# Altium schematic sheet ESP32-S2-Ink.SchDoc
size Tabloid; SheetNumber: 1; SheetTotal: 1
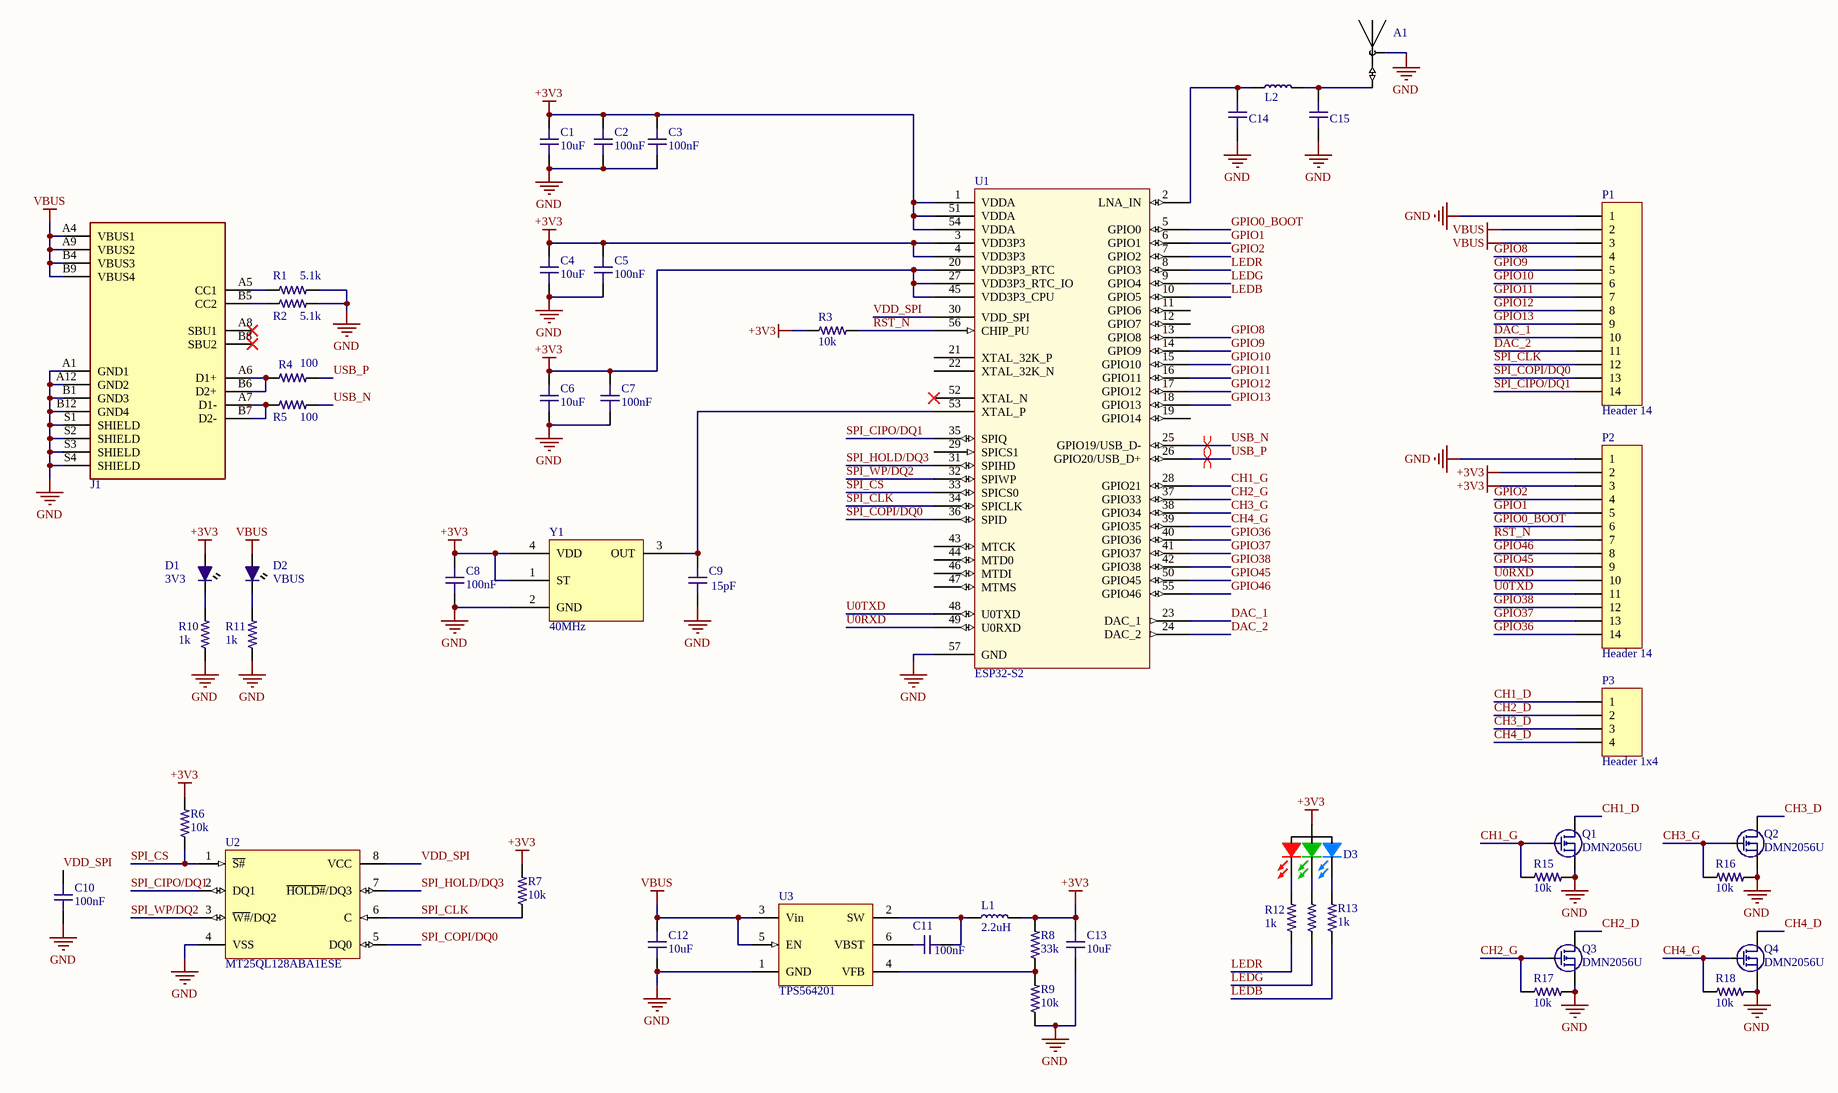
[diagram p0: ESP32-S2-Ink.SchDoc]

## Parts
A1  0479480001  [0479480001]  (value not drawn)
C1  value 10uF  [C0402-HIGH-DENSITY]  (hidden comment: C0402 10uF 10V)
C2  value 100nF  [C0402-HIGH-DENSITY]  (hidden comment: C0402 100nF 10V X5R)
C3  value 100nF  [C0402-HIGH-DENSITY]  (hidden comment: C0402 100nF 10V X5R)
C4  value 10uF  [C0402-HIGH-DENSITY]  (hidden comment: C0402 10uF 10V)
C5  value 100nF  [C0402-HIGH-DENSITY]  (hidden comment: C0402 100nF 10V X5R)
C6  value 10uF  [C0402-HIGH-DENSITY]  (hidden comment: C0402 10uF 10V)
C7  value 100nF  [C0402-HIGH-DENSITY]  (hidden comment: C0402 100nF 10V X5R)
C8  value 100nF  [C0402-HIGH-DENSITY]  (hidden comment: C0402 100nF 10V X5R)
C9  value 15pF  [C0402-HIGH-DENSITY]  (hidden comment: C0402 15pF 50V C0G)
C10  value 100nF  [C0402-HIGH-DENSITY]  (hidden comment: C0402 100nF 10V X5R)
C11  value 100nF  [C0402-HIGH-DENSITY]  (hidden comment: C0402 100nF 10V X5R)
C12  value 10uF  [C0402-HIGH-DENSITY]  (hidden comment: C0402 10uF 10V)
C13  value 10uF  [C0402-HIGH-DENSITY]  (hidden comment: C0402 10uF 10V)
C14  0402 Capacitor Template  [C0402-HIGH-DENSITY]  (value not drawn)
C15  0402 Capacitor Template  [C0402-HIGH-DENSITY]  (value not drawn)
D1  3V3  [LED0603-IPC]
D2  VBUS  [LED0603-IPC]
D3  RGB  [LED_0606_RGB_WURTH]  (value not drawn)
J1  16 Pin Mid Mount USB C  [USB-C - 16 Pin Mid Mount]  (value not drawn)
L1  value 2.2uH  [L1008]  (hidden comment: SDEM25201B-2R2MS)
L2  ! Inductor Template  [L0402-Murata-WW-High-Density]  (value not drawn)
P1  Header 14  [HDR1X14]
P2  Header 14  [HDR1X14]
P3  Header 1x4  [HEADER 1X4 SMD 2.54mm]
Q1  DMN2056U  [SOT23-DMN2056]
Q2  DMN2056U  [SOT23-DMN2056]
Q3  DMN2056U  [SOT23-DMN2056]
Q4  DMN2056U  [SOT23-DMN2056]
R1  value 5.1k  [R0402-HIGH-DENSITY]  (hidden comment: R0402 5.1K 1%)
R2  value 5.1k  [R0402-HIGH-DENSITY]  (hidden comment: R0402 5.1K 1%)
R3  value 10k  [R0402-HIGH-DENSITY]  (hidden comment: R0402 10k 1%)
R4  value 100  [R0402-HIGH-DENSITY]  (hidden comment: R0402 100R 1%)
R5  value 100  [R0402-HIGH-DENSITY]  (hidden comment: R0402 100R 1%)
R6  value 10k  [R0402-HIGH-DENSITY]  (hidden comment: R0402 10k 1%)
R7  value 10k  [R0402-HIGH-DENSITY]  (hidden comment: R0402 10k 1%)
R8  value 33k  [R0402-HIGH-DENSITY]  (hidden comment: R0402 33k 1%)
R9  value 10k  [R0402-HIGH-DENSITY]  (hidden comment: R0402 10k 1%)
R10  value 1k  [R0402-HIGH-DENSITY]  (hidden comment: R0402 1k 1%)
R11  value 1k  [R0402-HIGH-DENSITY]  (hidden comment: R0402 1k 1%)
R12  value 1k  [R0402-HIGH-DENSITY]  (hidden comment: R0402 1k 1%)
R13  value 1k  [R0402-HIGH-DENSITY]  (hidden comment: R0402 1k 1%)
R14  R0402 1k 1%  [R0402-HIGH-DENSITY]  (value not drawn)
R15  value 10k  [R0402-HIGH-DENSITY]  (hidden comment: R0402 10k 1%)
R16  value 10k  [R0402-HIGH-DENSITY]  (hidden comment: R0402 10k 1%)
R17  value 10k  [R0402-HIGH-DENSITY]  (hidden comment: R0402 10k 1%)
R18  value 10k  [R0402-HIGH-DENSITY]  (hidden comment: R0402 10k 1%)
U1  ESP32-S2  [QFN56]
U2  MT25QL128ABA1ESE  [SOIC127P800X216-8N]
U3  TPS564201  [SOT95P280X90-6N]
Y1  40MHz  [SiT8008B]

## Nets
+3V3: C1.2 C2.2 C3.2 C4.2 C5.2 C6.2 C7.2 C8.2 C13.2 D1.A D3.A L1.2 P2.2 P2.3 R3.1 R6.1 R7.1 R8.2 U1.1(VDDA) U1.3(VDD3P3) U1.4(VDD3P3) U1.20(VDD3P3_RTC) U1.27(VDD3P3_RTC_IO) U1.45(VDD3P3_CPU) U1.51(VDDA) U1.54(VDDA) Y1.1(ST) Y1.4(VDD)
GND: A1.2 C1.1 C2.1 C3.1 C4.1 C5.1 C6.1 C7.1 C8.1 C9.1 C10.1 C12.1 C13.1 C14.1 C15.1 J1.A1(GND1) J1.A12(GND2) J1.B1(GND3) J1.B12(GND4) J1.S1(SHIELD) J1.S2(SHIELD) J1.S3(SHIELD) J1.S4(SHIELD) P1.1 P2.1 Q1.2(S) Q2.2(S) Q3.2(S) Q4.2(S) R1.2 R2.2 R9.1 R10.1 R11.1 R15.1 R16.1 R17.1 R18.1 U1.57(GND) U2.4(VSS) U3.1(GND) Y1.2(GND)
VBUS: C12.2 D2.A J1.A4(VBUS1) J1.A9(VBUS2) J1.B4(VBUS3) J1.B9(VBUS4) P1.2 P1.3 U3.3(Vin) U3.5(EN)
CH1_D: P3.1 Q1.3(D)
CH1_G: Q1.1(G) R15.2 U1.28(GPIO21)
CH2_D: P3.2 Q3.3(D)
CH2_G: Q3.1(G) R17.2 U1.37(GPIO33)
CH3_D: P3.3 Q2.3(D)
CH3_G: Q2.1(G) R16.2 U1.38(GPIO34)
CH4_D: P3.4 Q4.3(D)
CH4_G: Q4.1(G) R18.2 U1.39(GPIO35)
DAC_1: P1.10 U1.23(DAC_1)
DAC_2: P1.11 U1.24(DAC_2)
GPIO0_BOOT: P2.6 U1.5(GPIO0)
GPIO1: P2.5 U1.6(GPIO1)
GPIO2: P2.4 U1.7(GPIO2)
GPIO8: P1.4 U1.13(GPIO8)
GPIO9: P1.5 U1.14(GPIO9)
GPIO10: P1.6 U1.15(GPIO10)
GPIO11: P1.7 U1.16(GPIO11)
GPIO12: P1.8 U1.17(GPIO12)
GPIO13: P1.9 U1.18(GPIO13)
GPIO36: P2.14 U1.40(GPIO36)
GPIO37: P2.13 U1.41(GPIO37)
GPIO38: P2.12 U1.42(GPIO38)
GPIO45: P2.9 U1.50(GPIO45)
GPIO46: P2.8 U1.55(GPIO46)
LEDB: R13.1 U1.10(GPIO5)
LEDG: R14.1 U1.9(GPIO4)
LEDR: R12.1 U1.8(GPIO3)
RST_N: P2.7 R3.2 U1.56(CHIP_PU)
SPI_CIPO/DQ1: P1.14 U1.35(SPIQ) U2.2(DQ1)
SPI_CLK: P1.12 R7.2 U1.34(SPICLK) U2.6(C)
SPI_COPI/DQ0: P1.13 U1.36(SPID) U2.5(DQ0)
SPI_CS: R6.2 U1.33(SPICS0) U2.1(~{S#})
SPI_HOLD/DQ3: U1.31(SPIHD) U2.7(~{HOLD#}/DQ3)
SPI_WP/DQ2: U1.32(SPIWP) U2.3(~{W#}/DQ2)
U0RXD: P2.10 U1.49(U0RXD)
U0TXD: P2.11 U1.48(U0TXD)
USB_N: R5.2 U1.25(GPIO19/USB_D-)
USB_P: R4.2 U1.26(GPIO20/USB_D+)
VDD_SPI: C10.2 U1.30(VDD_SPI) U2.8(VCC)
NetA1_1: A1.1(FEED) C15.2 L2.2
NetC9_2: C9.2 U1.53(XTAL_P) Y1.3(OUT)
NetC11_1: C11.1 L1.1 U3.2(SW)
NetC11_2: C11.2 U3.6(VBST)
NetC14_2: C14.2 L2.1 U1.2(LNA_IN)
NetD1_K: D1.K R10.2
NetD2_K: D2.K R11.2
NetD3_BK: D3.BK R13.2
NetD3_GK: D3.GK R14.2
NetD3_RK: D3.RK R12.2
NetJ1_A5: J1.A5(CC1) R1.1
NetJ1_A6: J1.A6(D1+) J1.B6(D2+) R4.1
NetJ1_A7: J1.A7(D1-) J1.B7(D2-) R5.1
NetJ1_B5: J1.B5(CC2) R2.1
NetR8_1: R8.1 R9.2 U3.4(VFB)

Not connected (* = marked no-connect by the designer): J1 A8(SBU1)* B8(SBU2)*; U1 11(GPIO6) 12(GPIO7) 19(GPIO14) 21(XTAL_32K_P) 22(XTAL_32K_N) 29(SPICS1) 43(MTCK) 44(MTD0) 46(MTDI) 47(MTMS) 52(XTAL_N)*

## Layout directives
differential pair: USB_N, USB_P

## Library data of the parts
A1 = Molex 0479480001: 2.4GHz Bluetooth, WLAN, Zigbee™ Chip RF Antenna 2.4GHz ~ 2.483.5GHz 3dBi Solder Surface Mount; Supplier 1: Digi-Key; Supplier 2: Mouser; Supplier Part Number 2: 538-47948-0001; Supplier Part Number 1: WM4893CT-ND
C1 C4 C6 C12 C13 = C0402 10uF 10V: Chip Capacitor, 0402, 10uF, 10V, X5R; EIA Code: X5R; Max. Voltage: 10V; Supplier 1: Digi-Key; Supplier Part Number 1: 1276-1450-2-ND
C2 C3 C5 C7 C8 C10 C11 = C0402 100nF 10V X5R: Chip Capacitor, 0402, 100nF, 10V, X5R; EIA Code: X5R; Max. Voltage: 10V; Supplier 1: Digi-Key; Supplier Part Number 1: 311-1336-1-ND
C9 = C0402 16pF 50V C0G: Chip Capacitor, 0402, 15pF, 50V, C0G; Max. Voltage: 50V; Supplier 1: Digi-Key; Supplier Part Number 1: 490-5926-1-ND; EIA Code: C0G
C14 C15 = 0402 Capacitor Template: Chip Capacitor, 0402, ??nF, 10V, X7R; EIA Code: X7R; Max. Voltage: 10V; Value: ??nF
D1 D2 = LED 0603 Yellow: LED YELLOW CLEAR 0603 SMD; Supplier 1: Digi-Key; Supplier Part Number 1: 732-4981-1-ND
D3 = Led_RGB_0606: RGB Led 1.6 x 1.6 mm Diffused; Manufacturer: Everlight; Manufacturer Part Number: 19-237/R6GHBHW-C01/2T; Supplier 1: Digi-Key; Supplier Part Number 1: 1080-1590-1-ND
J1 = USB C USB 2.0 and PD: USB-C USB 2.0 5A PD 16 Position Mid Mount; Manufacturer: Jing Extension of the Electronic Co; Supplier 1: LCSC; Supplier Part Number 1: C168688
L1 = SDEM25201B-2R2MS: 2.2µH Shielded Inductor 2.05A 117mOhm Max 1008 (2520 Metric); Supplier 1: Digi-Key; Supplier Part Number 1: 2037-SDEM25201B-2R2MSCT-ND
L2 = ! Inductor Template: Inductor, ??uH; Value: ??H
P1 P2 = Header 14: Header, 14-Pin; LatestRevisionDate: 17-Jul-2002; LatestRevisionNote: Re-released for DXP Platform.; Publisher: Altium Limited
P3 = Header 1x4: Header, 4-Pin; LatestRevisionDate: 17-Jul-2002; LatestRevisionNote: Re-released for DXP Platform.; Publisher: Altium Limited
Q1-Q4 = DMN2056U: MOSFET N-Ch -20V VDSS Enchanced Mosfet 4.2A; Supplier 1: Digi-Key; Supplier Part Number 1: DMN2056U-7DICT-ND
R1 R2 = R0402 5.1K 1%: RES SMD 5.1K OHM 1% 1/10W 0402; Temperature Coefficient: ±100ppm/°C; Features: Automotive AEC-Q200; Operating Temperature: -55°C ~ 155°C
R3 R6 R7 R9 R15-R18 = R0402 10k 1%: Chip Resistor, 0402, 10k ohms, 1%, 1/16 W; Supplier 1: Digi-Key; Supplier Part Number 1: 311-10.0KLRCT-ND
R4 R5 = R0402 100R 1%: Chip Resistor, 0402, 100 ohms, 1%, 1/16 W; Supplier 1: Digi-Key; Supplier Part Number 1: 311-100LRCT-ND
R8 = R0402 33k 1%: Chip Resistor, 0402, 33k ohms, 1%, 1/16 W; Supplier 1: Digi-Key; Supplier Part Number 1: 311-33.0KLRCT-ND
R10-R14 = R0402 1k 1%: Chip Resistor, 0402, 1k ohms, 1%, 1/16 W; Supplier 1: Digi-Key; Supplier Part Number 1: 311-1.00KLRCT-ND
  R14: Value: 1k
U1 = ESP32-S2: WiFi 802.11b/g/n Transceiver Module 2.4GHz QFN-56; Supplier 1: Digi-Key; Supplier 2: Mouser; Supplier Part Number 1: 1965-ESP32-S2CT-ND; Supplier Part Number 2: 356-ESP32-S2; Supplier 3: LCSC; Supplier Part Number 3: C529594
U2 = MT25QL128ABA1ESE: SPI Flash, 128Mb, 3V; Supplier 1: Mouser; Supplier Part Number 1: 340-224871-TRAY
U3 = TPS564201: Buck Converter, 4.5-17V in, 0.76-7V out, 4A, TSOT-6; Manufacturer: Texas Instruments; Supplier: Digi-Key; Supplier Part Number: 296-44195-1-ND; Manufacturer Part Number: TPS564201; Last Modified By: Peter Kazakoff; Last Modified Date: November 13th 2016; Supplier 1: Digi-Key; Supplier Part Number 1: 296-44195-1-ND
Y1 = 40MHZ CMOS ±10ppm: OSC MEMS 40.0000MHZ 1.8-3.3V 2016 SMD 15pF Load; Frequency Stability: ±10ppm; Current - Supply (Max): 4.5mA; Output: CMOS; Operating Temperature: -40°C ~ 85°C; Supplier 3: LCSC; Supplier Part Number 3: C669085